# EAGLE schematic fotoresistenza_v1_rev0 (EAGLE 6.5.0)
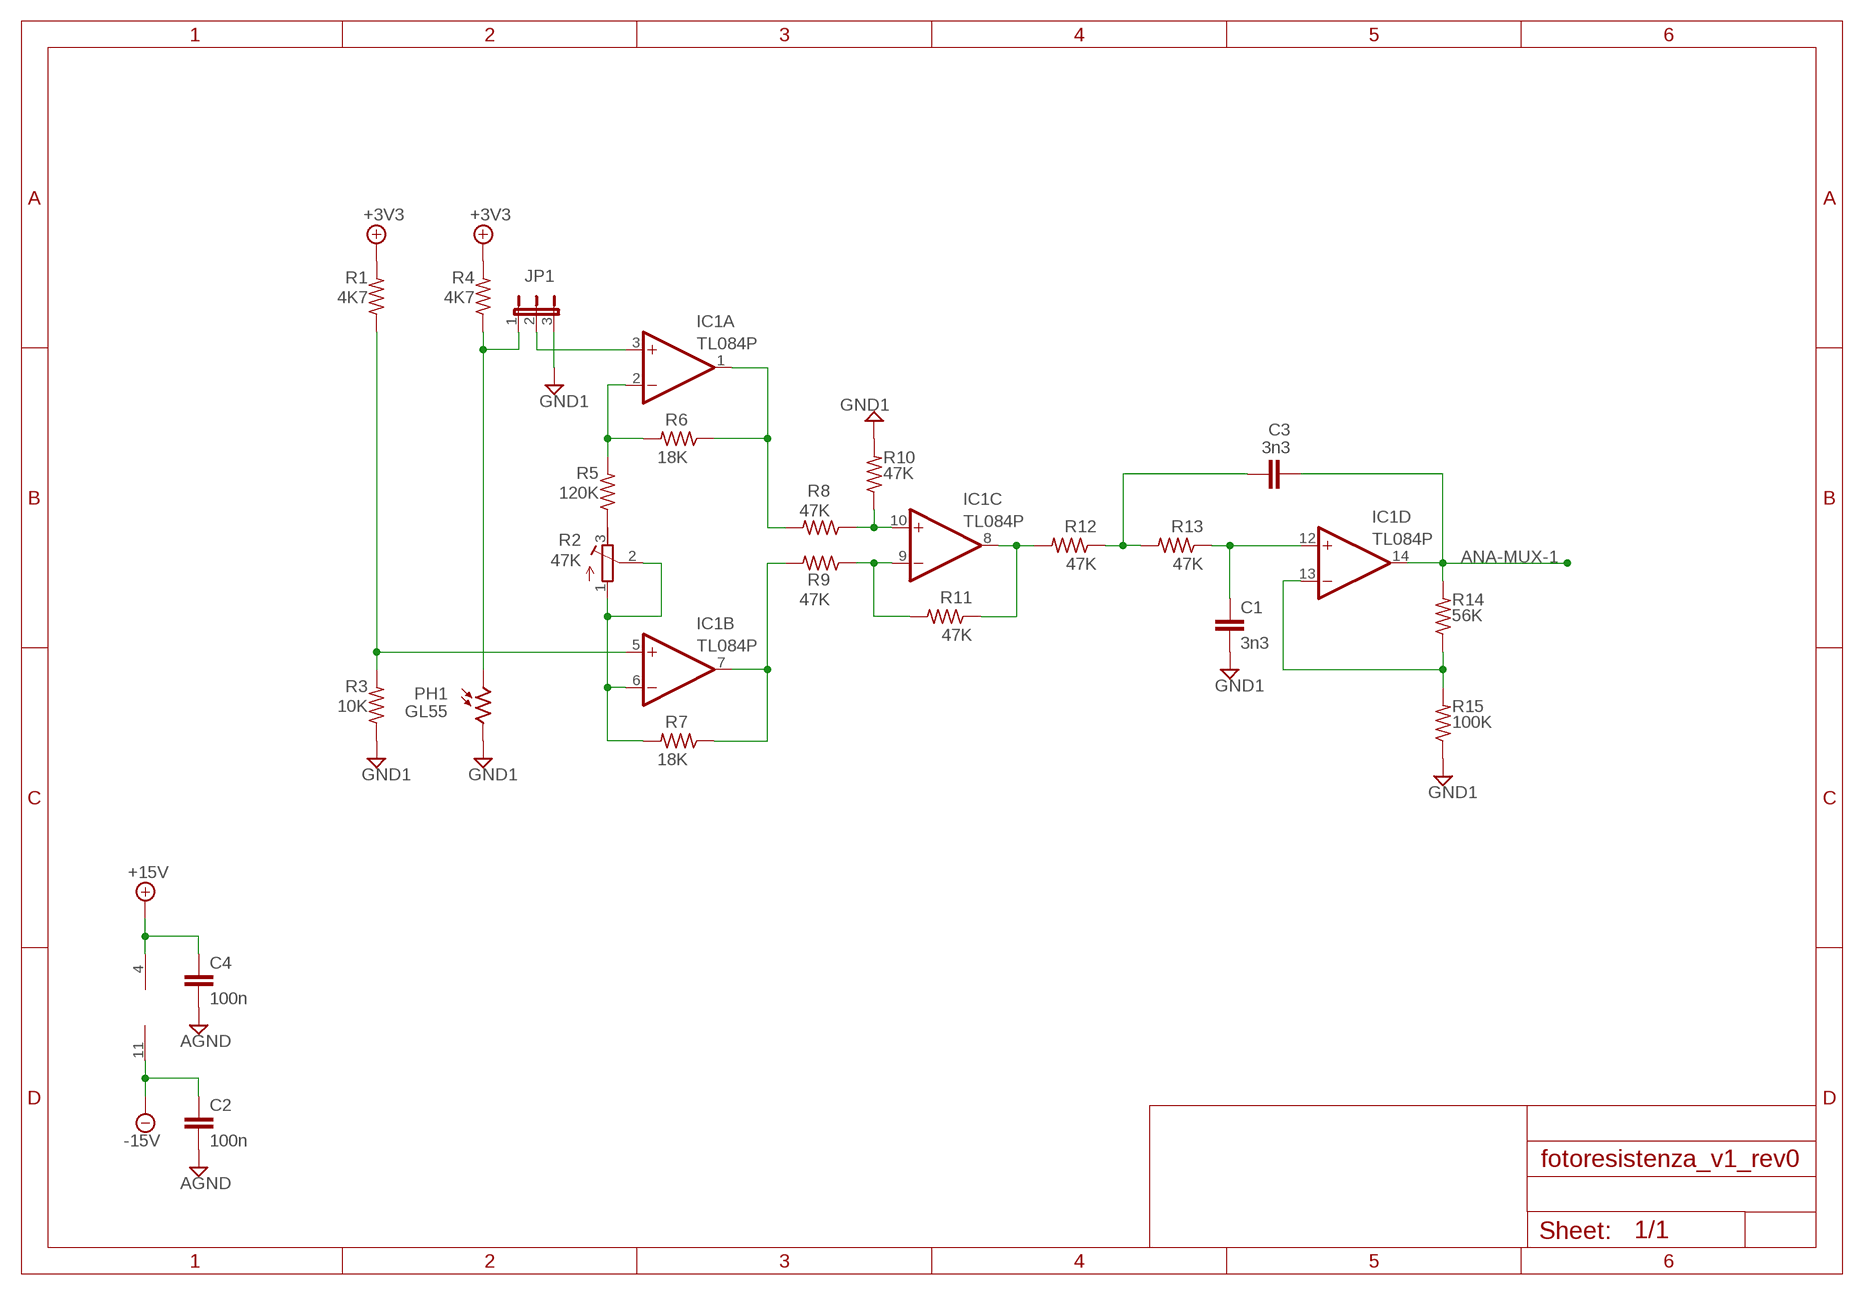
[diagram p0: schematic, sheet 1]

## Parts
C1  3n3  C-EU025-025X050  [C025-025X050]
C2  100n  C-EU025-025X050  [C025-025X050]
C3  3n3  C-EU025-025X050  [C025-025X050]
C4  100n  C-EU025-025X050  [C025-025X050]
IC1  TL084P  [DIL14]
JP1  JP2E  [JP2]
PH1  GL55  B1060_23  [TO-8_B10]
R1  4K7  R-US_0204/7  [0204/7]
R2  47K  R-TRIMM64W  [RTRIM64W]
R3  10K  R-US_0204/7  [0204/7]
R4  4K7  R-US_0204/7  [0204/7]
R5  120K  R-US_0204/7  [0204/7]
R6  18K  R-US_0204/7  [0204/7]
R7  18K  R-US_0204/7  [0204/7]
R8  47K  R-US_0204/7  [0204/7]
R9  47K  R-US_0204/7  [0204/7]
R10  47K  R-US_0204/7  [0204/7]
R11  47K  R-US_0204/7  [0204/7]
R12  47K  R-US_0204/7  [0204/7]
R13  47K  R-US_0204/7  [0204/7]
R14  56K  R-US_0204/7  [0204/7]
R15  100K  R-US_0204/7  [0204/7]

## Nets
+4.1V: R1.2 R4.2 ; supply symbol labelled +3V3
+15V: C4.1 IC1.4(P:V+)
-15V: C2.1 IC1.11(P:V-)
AGND: C2.2 C4.2
ANA-MUX-1: C3.2 IC1.14(D:OUT) R14.2
GND1: C1.2 JP1.3 PH1.2 R3.1 R10.2 R15.1
N$1: IC1.5(B:+IN) R1.1 R3.2
N$2: JP1.1 PH1.1 R4.1
N$3: R2.3(A) R5.1
N$4: IC1.6(B:-IN) R2.1(E) R2.2(S) R7.2
N$5: IC1.7(B:OUT) R7.1 R9.2
N$6: IC1.1(A:OUT) R6.1 R8.2
N$7: IC1.2(A:-IN) R5.2 R6.2
N$8: C3.1 R12.1 R13.2
N$9: IC1.10(C:+IN) R8.1 R10.1
N$10: IC1.9(C:-IN) R9.1 R11.2
N$11: IC1.8(C:OUT) R11.1 R12.2
N$12: C1.1 IC1.12(D:+IN) R13.1
N$13: IC1.13(D:-IN) R14.1 R15.2
N$14: IC1.3(A:+IN) JP1.2

## Library data of the parts
C1-C4 = rcl:C-EU: CAPACITOR, European symbol
IC1 = linear:TL084: OP AMP
JP1 = jumper:JP2E: JUMPER
PH1 = photo-elements:?1060*: Sensor Street Light control Source: http://optoelectronics.perkinelmer.com/content/Datasheets/DTS_PhotocellsB1060.pdf; TYPE: GL55
R1 R3-R15 = rcl:R-US_: RESISTOR, American symbol
R2 = resistor:R-TRIMM: Trimm resistor